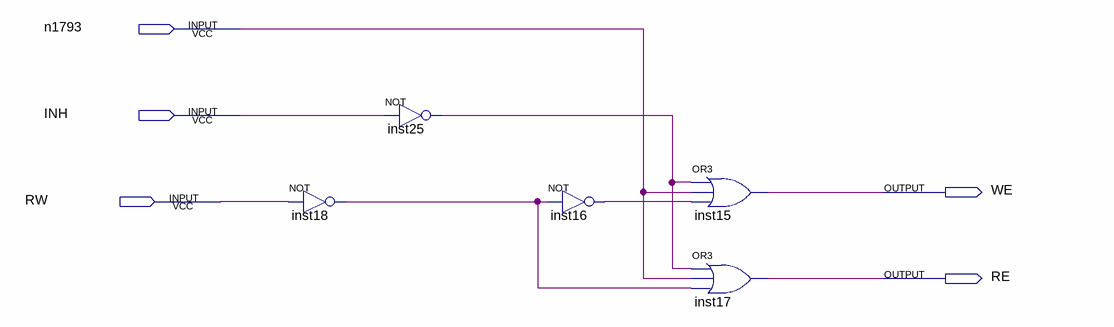
[diagram p0: schematic sheet]
// Quartus schematic CS_FDC.bdf as structural Verilog: 5 symbols, 5 pins
module CS_FDC (
  input  n1793,
  input  INH,
  input  RW,
  output WE,
  output RE
);

  wire inst16_out, inst18_out, inst25_out;

  not inst18 (inst18_out, RW);
  not inst25 (inst25_out, INH);
  not inst16 (inst16_out, inst18_out);
  or inst15 (WE, inst25_out, n1793, inst16_out);
  or inst17 (RE, inst25_out, n1793, inst18_out);
endmodule
